# Altium project motion_board.PrjPcb
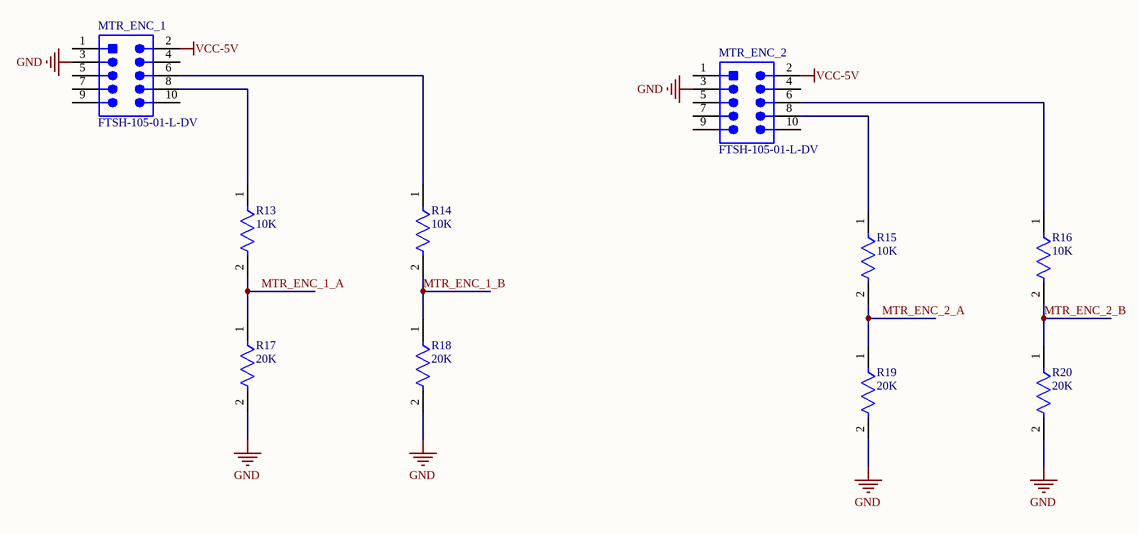
[diagram p0: MotorEncoders.SchDoc]
5 sheets, 27 parts. Net scope: global (net labels, ports and power ports of the same name join across sheets).
Board file: PCB_new.PcbDoc
Sheets:
  MotorEncoders.SchDoc
  Power.SchDoc
  STM32.SchDoc
  VoltageRegulator_3v3.SchDoc
  STLink.SchDoc

## Sheet MotorEncoders.SchDoc
size A; SheetNumber: 2; SheetTotal: 10

### Parts
MTR_ENC_1  FTSH-105-01-L-DV  [SMTC-FTSH-105-01-L-DV_V]
MTR_ENC_2  FTSH-105-01-L-DV  [SMTC-FTSH-105-01-L-DV_V]
R13  10K  [FP-RC0603-0_55-IPC_C]
R14  10K  [FP-RC0603-0_55-IPC_C]
R15  10K  [FP-RC0603-0_55-IPC_C]
R16  10K  [FP-RC0603-0_55-IPC_C]
R17  20K  [FP-RC0603-0_55-IPC_C]
R18  20K  [FP-RC0603-0_55-IPC_C]
R19  20K  [FP-RC0603-0_55-IPC_C]
R20  20K  [FP-RC0603-0_55-IPC_C]

### Nets
GND: MTR_ENC_1.3 MTR_ENC_2.3 R17.2 R18.2 R19.2 R20.2
VCC-5V: MTR_ENC_1.2 MTR_ENC_2.2
MTR_ENC_1_A: R13.2 R17.1
MTR_ENC_1_B: R14.2 R18.1
MTR_ENC_2_A: R15.2 R19.1
MTR_ENC_2_B: R16.2 R20.1
NetMTR_ENC_1_6: MTR_ENC_1.6 R14.1
NetMTR_ENC_1_8: MTR_ENC_1.8 R13.1
NetMTR_ENC_2_6: MTR_ENC_2.6 R16.1
NetMTR_ENC_2_8: MTR_ENC_2.8 R15.1

Not connected (* = marked no-connect by the designer): MTR_ENC_1 1 4 5 7 9 10; MTR_ENC_2 1 4 5 7 9 10

### Library data of the parts
MTR_ENC_1 MTR_ENC_2 = CMP-2000-05354-1: Male Header, Pitch 1.27 mm, 2 x 5 Position, Height 5.96 mm, -55 to 125 degC, RoHS, Bulk; Manufacturer: Samtec; Connector Type: Header,Unshrouded; Pitch: 0.050"(1.27mm); Mating Products: FLE-105-01-G-DV-TR-ND-CONNSKT1.27MM10POSDUALSMDCLP-105-02-G-D-P-TR-ND-CONNRCPT10POSDUAL.05"SMDSFMC-105-L2-S-D-TR-ND-CONN.05"SURFACE10POSSMTSFMH-105-02-L-D-TR-ND-CONNRECEPT10POS.50"SMTFLE-105-01-G-DV-A-ND-CONNSKT1.27MM10POSDUALSMDCLP-105-02-G-D-BE-ND-CONNRCPT10POSDUAL.05"SMDFLE-105-01-G-DV-A-P-ND-CONNSKT1.27MM10POSDUALSMDSAM1153-05-ND-CONNRCPT10POSDUAL.05"SMDSAM1155-05-ND-CONNRCPT10POSDUAL.05"SMDSAM1154-05-ND-CONNRCPT10POSDUAL.05"SMDSFMH-105-02-L-D-LC-ND-CONNRECEPT10POS.50"SMTSAM1226-05-ND-CONNRCPT.05"10POSDUALSMD; Catalog Drawings: FTSHSeriesFTSHSeriesSMTSide; Other Names: SAM1161-05; EDA / CAD Models: DownloadfromAcceleratedDesigns; Number of Positions Loaded: All; Number of Positions: 10; Featured Product: Board-To-BoardInterconnectSystems; Online Catalog: FTSHSeries; Product Training Modules: Board-to-BoardConnectors; Category: Connectors,Interconnects; Number of Rows: 2; Contact Finish: Gold; Termination: Solder; Mounting Type: SurfaceMount; Series: FTSH; Contact Mating Length: 0.120"(3.05mm); Row Spacing: 0.050"(1.27mm); Datasheet URL: https://datasheet.ciiva.com/30493/0900766b80adfe36-30493006.pdf; Contact Finish Thickness: 10µin(0.25µm); Features: -; Standard Package: 1; Packaging: Bulk; Datasheet Version: Feb-08; Manufacturer URL: http://www.samtec.com/; Fastening Type: -; Family: RectangularConnectors-Headers,MalePins; Contact Type: MalePin; Color: Black
R13-R16 = CMP-2100-03664-2: RES 10K OHM 1% 1/10W 0603; Voltage Rating: 75V; Voltage Rating (DC): 50V; Resistance: 10kR; Power Rating: 100mW; Temperature Coefficient: 100ppm/°C; Depth: 0.8mm; Termination: SMD/SMT; Resistor Type: Thick Film; Series: RC; Construction: Rectangular; Features: Moisture Resistant; Packaging: Tape and Reel; Min Operating Temperature: -55°C; Number of Terminations: 2; Lead Pitch: 0.3mm; RoHS Compliant: Yes; Case/Package: 0603; Resistance Tolerance: 1%; Military Standard: Not; Weight: 7.1E-05oz; Number of Pins: 2; Tolerance: 1%; Length: 1.6mm; Case Code (Imperial): 0603; Lead Free: Lead Free; Width: 0.8mm; Max Power Dissipation: 100mW; Height: 0.45mm; Max Operating Temperature: 155°C; Case Code (Metric): 1608; Size Code: 0603
R17-R20 = CMP-2000-06932-2: RES 20K OHM 1% 1/10W 0603; Voltage Rating: 50V; Temperature Coefficient: 100ppm/°C; Power Rating: 100mW; Resistance: 20kR; Height: 0.022inch; REACH SVHC: No SVHC; Case Code (Metric): 1608; Depth: 0.8mm; Tolerance: 1%; Min Operating Temperature: -55°C; Series: RC; RoHS Compliant: Yes; Resistor Type: Thick Film; Max Power Dissipation: 100mW; Features: Moisture Resistant; Max Operating Temperature: 155°C; Package Quantity: 1; Size Code: 0603; Packaging: Tape and Reel; Width: 0.031inch; Length: 0.063inch; Military Standard: Not; Technology: THICK FILM; Number of Terminations: 2; Termination: SMD/SMT; Construction: Rectangular; Case/Package: 0603; Number of Pins: 2; Lead Free: Lead Free; Voltage Rating (DC): 50V; Resistance Tolerance: 1%; Case Code (Imperial): 0603

## Sheet Power.SchDoc
size A; SheetNumber: 4; SheetTotal: 10
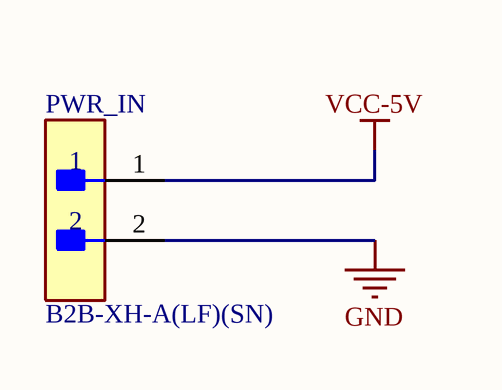
[diagram p1: Power.SchDoc]

### Parts
PWR_IN  B2B-XH-A(LF)(SN)  [FP-B2B-XH-A_LF_SN-MFG]

### Nets
GND: PWR_IN.2
VCC-5V: PWR_IN.1

### Library data of the parts
PWR_IN = CMP-2000-05888-3: CONN HEADER VERT 2POS 2.5MM; Current Rating: 3A; Voltage Rating: 250V; Number of Contacts: 2; Contact Resistance: 20mR; Wire/Cable Gauge: 22AWG; Insulation Resistance: 1GR; Connector Type: Male Pin; Packaging: Bulk; Contact Material: Brass; Lead Free: Lead Free; Orientation: Straight; Contact Plating: Tin; Max Current Rating: 3A; Termination: Solder; Fastening Type: Detent; Depth: 5.75mm; Housing Material: Polyamide; REACH SVHC: No SVHC; Series: XH; Voltage Rating (AC): 250V; Number of Positions: 2; Color: Natural; Contact Type: Male Pin; Max Voltage Rating (DC): 250V; Pitch: 2.5mm; Lead Pitch: 2.5mm; Mount: Through Hole; Max Operating Temperature: 85°C; Length: 7.4mm; Max Voltage Rating (AC): 250V; Min Operating Temperature: -25°C; Number of Rows: 1; Housing Color: White

## Sheet STM32.SchDoc
size A; SheetNumber: 5; SheetTotal: 10
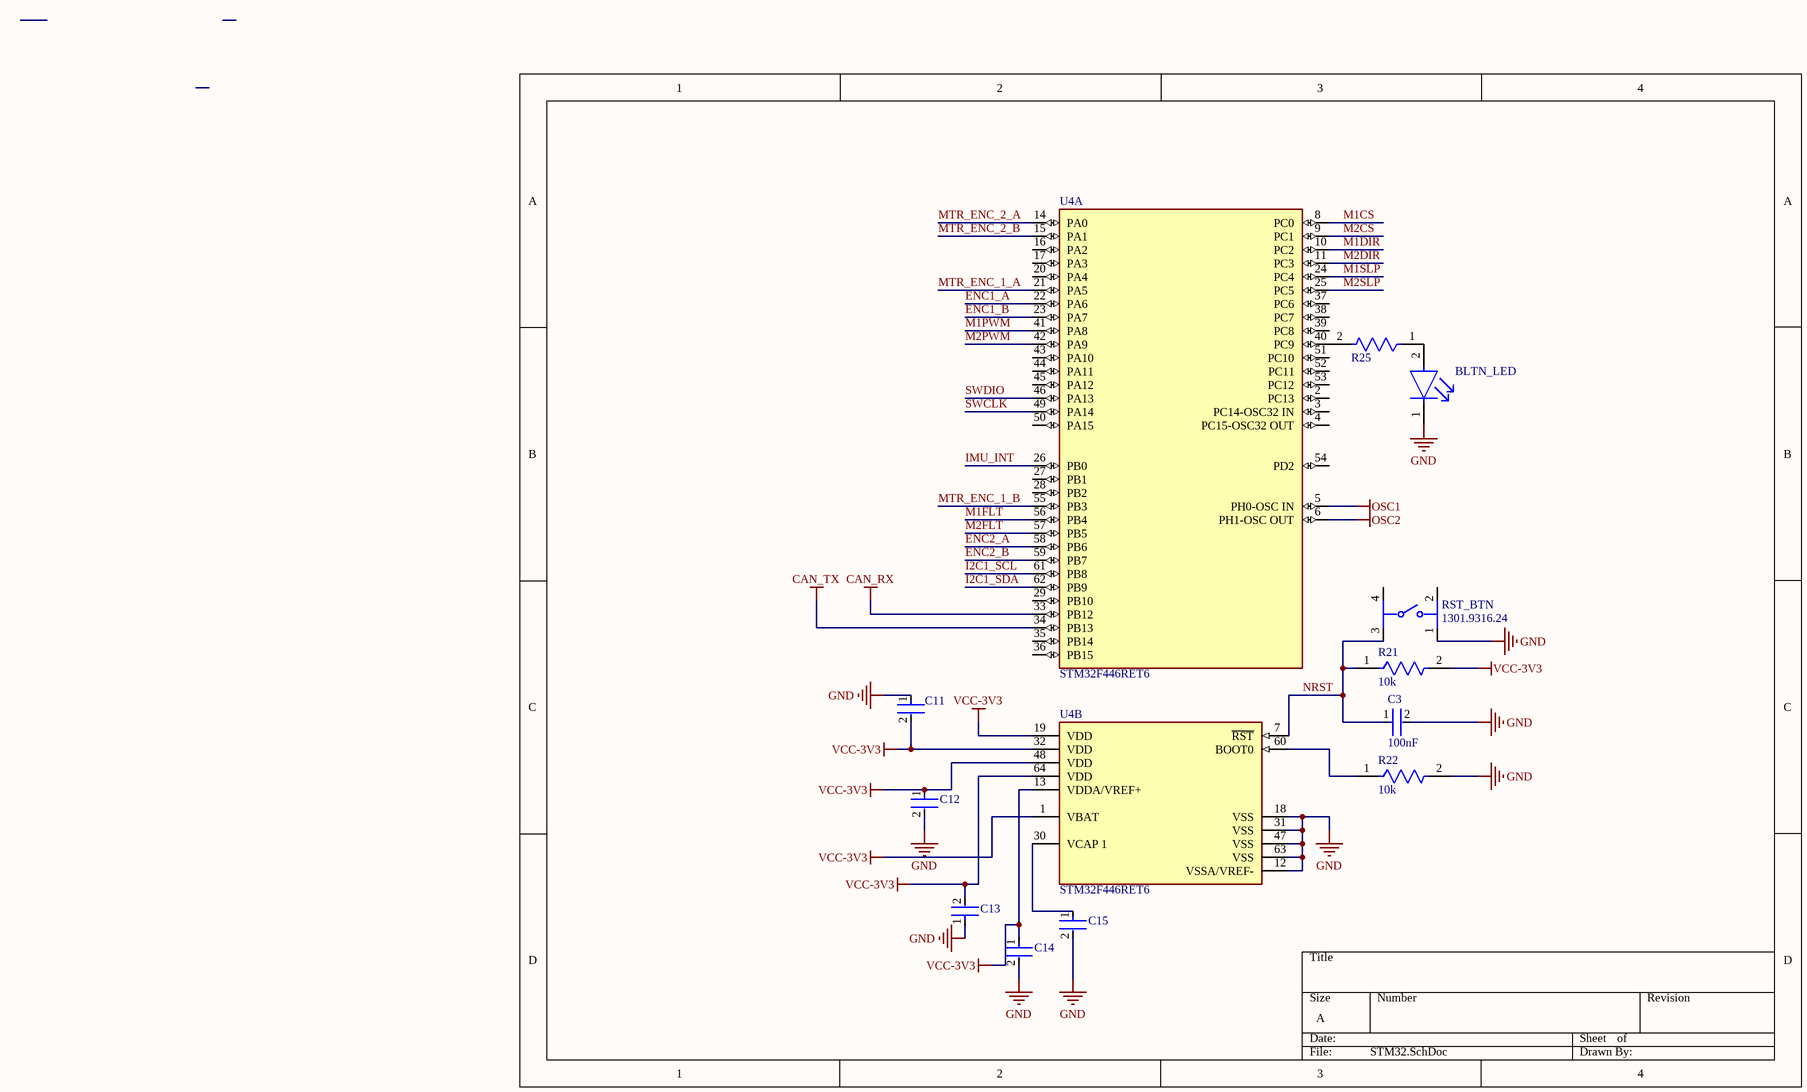
[diagram p2: STM32.SchDoc]

### Parts
BLTN_LED  APHCM2012CGCK-F01  [FP-APHCM2012CGCK-F01-MFG]  (value not drawn)
C3  100nF  [FP-0402B104K160CT-IPC_C]
C11  CC0603KRX7R9BB104  [FP-CC0603-DA-MFG]  (value not drawn)
C12  CC0603KRX7R9BB104  [FP-CC0603-DA-MFG]  (value not drawn)
C13  CC0603KRX7R9BB104  [FP-CC0603-DA-MFG]  (value not drawn)
C14  CC0603KRX7R9BB104  [FP-CC0603-DA-MFG]  (value not drawn)
C15  CL10A475KP8NNNC  [FP-CL10-IPC_C]  (value not drawn)
R21  10k  [FP-RC0603-0_55-IPC_C]
R22  10k  [FP-RC0603-0_55-IPC_C]
R25  AC0603FR-10470RL  [FP-AC0603-IPC_A]  (value not drawn)
RST_BTN  1301.9316.24  [FP-1301_9316_24-MFG]
U4  STM32F446RET6  [FP-LQFP64-5W-MFG]  (parts A,B of 2)

### Nets
CAN_RX: U4.33(PB12)
CAN_TX: U4.34(PB13)
GND: BLTN_LED.1(C) C3.2 C11.1 C12.2 C13.1 C14.2 C15.2 R22.2 RST_BTN.1 U4.12(VSSA/VREF-) U4.18(VSS) U4.31(VSS) U4.47(VSS) U4.63(VSS)
OSC1: U4.5(PH0-OSC_IN)
OSC2: U4.6(PH1-OSC_OUT)
VCC-3V3: C11.2 C12.1 C13.2 C14.1 R21.2 U4.1(VBAT) U4.13(VDDA/VREF+) U4.19(VDD) U4.32(VDD) U4.48(VDD) U4.64(VDD)
ENC1_A: U4.22(PA6)
ENC1_B: U4.23(PA7)
ENC2_A: U4.58(PB6)
ENC2_B: U4.59(PB7)
I2C1_SCL: U4.61(PB8)
I2C1_SDA: U4.62(PB9)
IMU_INT: U4.26(PB0)
M1CS: U4.8(PC0)
M1DIR: U4.10(PC2)
M1FLT: U4.56(PB4)
M1PWM: U4.41(PA8)
M1SLP: U4.24(PC4)
M2CS: U4.9(PC1)
M2DIR: U4.11(PC3)
M2FLT: U4.57(PB5)
M2PWM: U4.42(PA9)
M2SLP: U4.25(PC5)
MTR_ENC_1_A: U4.21(PA5)
MTR_ENC_1_B: U4.55(PB3)
MTR_ENC_2_A: U4.14(PA0)
MTR_ENC_2_B: U4.15(PA1)
NRST: C3.1 R21.1 RST_BTN.3 U4.7(~{RST})
SWCLK: U4.49(PA14)
SWDIO: U4.46(PA13)
NetBLTN_LED_2: BLTN_LED.2(A) R25.1
NetC15_1: C15.1 U4.30(VCAP_1)
NetR22_1: R22.1 U4.60(BOOT0)
NetR25_2: R25.2 U4.40(PC9)

Not connected (* = marked no-connect by the designer): RST_BTN 2 4; U4 2(PC13) 3(PC14-OSC32_IN) 4(PC15-OSC32_OUT) 16(PA2) 17(PA3) 20(PA4) 27(PB1) 28(PB2) 29(PB10) 35(PB14) 36(PB15) 37(PC6) 38(PC7) 39(PC8) 43(PA10) 44(PA11) 45(PA12) 50(PA15) 51(PC10) 52(PC11) 53(PC12) 54(PD2)

### Library data of the parts
BLTN_LED = CMP-44529-000062-1: LED GREEN CLEAR CHIP SMD; Dominant Wavelength: 570nm; Forward Current: 20mA; Number of LEDs: 1; Luminous Intensity: 40mcd; Forward Voltage: 2.1V; Viewing Angle: 110°; Illumination Color: Green; Lens Style: Clear; Mount: Surface Mount; Length: 2mm; Max Operating Temperature: 85°C; Series: APHCM; Width: 1.25mm; Lead Free: Lead Free; Wavelength: 570nm; Package Quantity: 1; Number of Pins: 2; Case Code (Metric): 2012; RoHS Compliant: Yes; Packaging: Tape and Reel; Lens Color: Clear; Case/Package: 0805; Case Code (Imperial): 0805; Test Current: 20mA; Color: Green; Min Operating Temperature: -40°C; Height: 0.4mm
C3 = CMP-45632-000002-1: CAP CER 0.1UF 16V X7R 0402; Tolerance: 10%; Case Code (Imperial): 0402; Length: 1mm; Radiation Hardening: No; Case Code (Metric): 1005; Max Operating Temperature: 125°C; Voltage Rating: 16V; Capacitance: 100nF; Voltage Rating (DC): 16V; Dielectric: X7R; RoHS Compliant: Yes; Packaging: Tape and Reel; Lead Free: Lead Free; Depth: 0.5mm; Case/Package: 0402; Min Operating Temperature: -55°C; Series: -
C11-C14 = CMP-2100-03601-2: CAP CER 0.1UF 50V X7R 0603; Manufacturer: YAGEO; Material: Ceramic; Capacitance: 100 nF; Temperature Coefficient: 15%; Tolerance: 0.1; Value: 100 nF; Description: CC0603 100 nF X7R 10.00% 50 V; Height: 0.9mm; Voltage: 50 V; ComponentLink2Description: Datasheet; Device Class L2: Capacitors; Temperature Range High: +125°C; Category: Cap; Footprint Url: http://www.yageo.com/exep/pages/download/literatures/UPY-C_GEN_24.pdf; ComponentLink2URL: http://www.yageo.com/documents/recent/UPY-GPHC_X7R_6.3V-to-50V_18.pdf; Package: CC0603-DA; Temperature: -55°C to +125°C; Voltage Rating: 50 V; Temperature Characteristic: X7R; Device Class L1: Passive Components; Temperature Range Low: -55°C; Manufacturer Part Number: CC0603KRX7R9BB104; RoHS: TRUE; Automotive: No; Device Class L3: Ceramic Capacitors; Octopart: https://octopart.com/cc0603krx7r9bb104-yageo-42244635; Mouser Description: Multilayer Ceramic Capacitor, CC Series, 0.1 - F, - 10%, X7R, 50 V, 0603 [1608 Metric]; Lead Free: Yes; Digikey Description: CAP CER 0.1UF 50V X7R 0603
C15 = CMP-13271-003017-1: Cap Ceramic 4.7uF 10V X5R ±10% Pad SMD 0603 +85°C T/R; Capacitance: 4.7uF; Case/Package: 0603; Packaging: Tape and Reel; Width: 0.031inch; Contact Plating: Tin; Thickness: 0.035inch; Package Quantity: 1; Voltage Rating: 10V; Case Code (Metric): 1608; Case Code (Imperial): 0603; Depth: 0.8mm; Height: 0.8mm; Tolerance: 10%; Max Operating Temperature: 85°C; Length: 1.6mm; Dielectric: X5R; Mount: Surface Mount; Radiation Hardening: No; Min Operating Temperature: -55°C
R21 R22 = CMP-2100-03664-2: as R13 on sheet MotorEncoders; Depth: 0.8mm; Termination: SMD/SMT; Resistor Type: Thick Film; Series: RC; Construction: Rectangular; Features: Moisture Resistant; Packaging: Tape and Reel; Min Operating Temperature: -55°C; Number of Terminations: 2; Lead Pitch: 0.3mm; RoHS Compliant: Yes; Case/Package: 0603; Resistance Tolerance: 1%; Military Standard: Not; Weight: 7.1E-05oz; Number of Pins: 2; Tolerance: 1%; Length: 1.6mm; Case Code (Imperial): 0603; Lead Free: Lead Free; Width: 0.8mm; Max Power Dissipation: 100mW; Height: 0.45mm; Max Operating Temperature: 155°C; Case Code (Metric): 1608; Size Code: 0603
R25 = CMP-03412-002877-2: RES 470Ω 1.00% 0.1W 0603; Tolerance: 1%; Resistance: 470R; Case/Package: 0603; RoHS Compliant: Yes
RST_BTN = CMP-26321-000004-1: LSH 6X6 SHORT TRAVEL SWITCH 7.00; Voltage Rating (DC): 12V; Mechanical Life: 100000Cycles; Throw Configuration: SPST; Operating Force: 1.6N; Max Current Rating: 50mA; Min Operating Temperature: -20°C; Mount: Surface Mount; Max Voltage Rating (DC): 12V; Length: 6mm; Packaging: Tape and Reel; Case/Package: SMD/SMT; Radiation Hardening: No; Orientation: Straight; Termination: Gull Wing; RoHS Compliant: Yes; Max Operating Temperature: 70°C; Depth: 10mm
U4 = CMP-12105-000007-1: IC MCU 32BIT 512KB FLASH 64LQFP; Manufacturer: ST; Number Of Spi Channels: 4; Ram Size: 128KBytes; Standoff Height: 0.05mm; Number Of Uart Channels: 6; Number Of Pwm Channels: 32; Max Junction Temp: +105°C; Number Of I/Os: 50; Number Of Usb Channels: 2; Frequency: 180MHz; Number Of A/D Converters: 3; Max Supply Voltage: 3.6V; Number Of Adc Channels: 16; Interface: I2C,SPI,UART,USART,CAN,USB,LIN,IrDA,I2S,Other; Memory Size: 512KBytes; Number Of Timers/Counters: 14; Min Supply Voltage: 1.7V; Core Architecture: ARM Cortex-M4; Data Bus Width: 32bits; Number Of Cores: 1; Ambient Temperature Range Low: -40°C; ComponentLink2URL: https://www.st.com/en/microcontrollers-microprocessors/stm32f446re.html; Category: IC; Height: 1.6mm; Ipc Land Pattern Name: QFP50P1200X1200X160-64; Manufacturer Part Number: STM32F446RET6; Octopart: https://octopart.com/stm32f446ret6-stmicroelectronics-52642920; Temperature Range High: +105°C; Lead Free: Yes; Mouser Description: ARM Microcontrollers - MCU High-performance and DSP with FP, ARM Cortex-M4 MCU with 512 Kbytes Flash, 180 MHz CPU, Art Accelerator, SDRAM; Digikey Description: IC MCU 32BIT 512KB FLASH 64LQFP; Ambient Temperature Range High: +85°C; Number Of I2C Channels: 4; Memory Type: FLASH; RoHS: TRUE; Automotive: No; Device Class L1: Integrated Circuits (ICs); Temperature: -40°C to +105°C; Device Class L2: Embedded Processors and Controllers; Device Class L3: Microcontrollers; Temperature Range Low: -40°C; Package: LQFP64-5W; ComponentLink2Description: Datasheet

## Sheet VoltageRegulator_3v3.SchDoc
size A; SheetNumber: 6; SheetTotal: 10
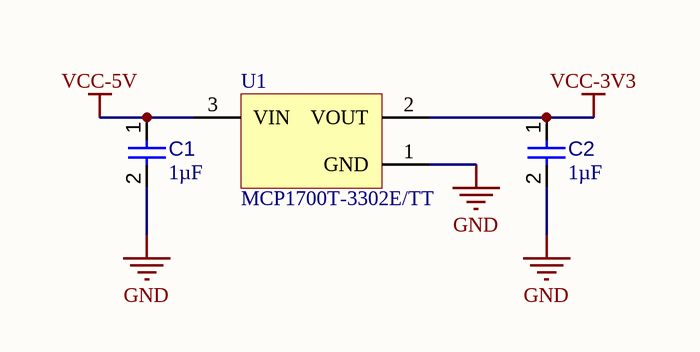
[diagram p3: VoltageRegulator_3v3.SchDoc]

### Parts
C1  value 1µF  [CAPC0603(1608)100_L]  (hidden comment: Capacitor 1µF +/-40% 50V 0603)
C2  value 1µF  [CAPC0603(1608)100_L]  (hidden comment: Capacitor 1µF +/-40% 50V 0603)
U1  MCP1700T-3302E/TT  [SOT-23-TT3_N]

### Nets
GND: C1.2 C2.2 U1.1(GND)
VCC-3V3: C2.1 U1.2(VOUT)
VCC-5V: C1.1 U1.3(VIN)

### Library data of the parts
C1 C2 = CMP-001-00078-4: Chip Capacitor, 1µF +/-40%, 50V, 0603, Thickness 1 mm; Tolerance: 10%; Min Operating Temperature: -55°C; Max Operating Temperature: 85°C; Case/Package: 0603; Voltage Rating: 50V; Pins: 2; Mounting Technology: SMT
U1 = CMP-0136-00791-1: Low Quiescent Current LDO, 3-Pin SOT-23, Extended Temperature, Tape and Reel; PackageVersion: revBB, Aug-2009; Code_IPC: SOT23-3; PackageReference: SOT-23-TT3; DatasheetVersion: revB, Feb-2007; PackageDescription: 3-Lead Plastic Small Outline Transistor (TT) [SOT-23]

## Sheet STLink.SchDoc
size A; SheetNumber: 7; SheetTotal: 10
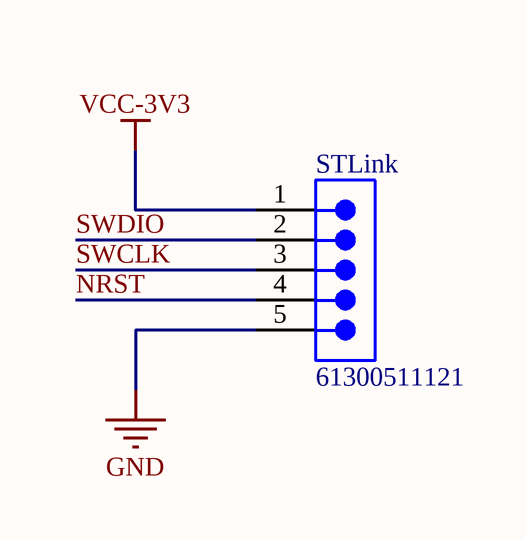
[diagram p4: STLink.SchDoc]

### Parts
STLink  61300511121  [61300511121]

### Nets
GND: STLink.5
VCC-3V3: STLink.1
NRST: STLink.4
SWCLK: STLink.3
SWDIO: STLink.2

### Library data of the parts
STLink = CMP-1502-01068-4: THT Vertical Pin Header WR-PHD, Pitch 2.54 mm, Single Row, 5 pins; Number of Contacts: 5; Connector Type: Male Pin; Operating Supply Voltage: 250V; Contact Resistance: 20mΩ; Gender: Male; Pitch: 2.54mm; Current Rating: 3A; Min Operating Temperature: -40°C; Contact Material: Gold; Color: Black; RoHS: Compliant; Number of Rows: 1; Lead Free: Lead Free; Height: 8.89mm; Contact Plating: Gold; Number of Pins: 5; Orientation: Vertical; Voltage Rating: 250V; Packaging: Bulk; Number of Positions: 5; Max Operating Temperature: 105°C; Termination: Solder; Lead Pitch: 2.54mm; Contact Mating Length: 5.9944mm; Mount: Through Hole

## Nets that join several sheets
GND: MotorEncoders (6 pins), Power (PWR_IN.2), STM32 (14 pins), VoltageRegulator_3v3 (C1.2 C2.2 U1.1), STLink (STLink.5)
VCC-3V3: STM32 (11 pins), VoltageRegulator_3v3 (C2.1 U1.2), STLink (STLink.1)
VCC-5V: MotorEncoders (MTR_ENC_1.2 MTR_ENC_2.2), Power (PWR_IN.1), VoltageRegulator_3v3 (C1.1 U1.3)
MTR_ENC_1_A: MotorEncoders (R13.2 R17.1), STM32 (U4.21)
MTR_ENC_1_B: MotorEncoders (R14.2 R18.1), STM32 (U4.55)
MTR_ENC_2_A: MotorEncoders (R15.2 R19.1), STM32 (U4.14)
MTR_ENC_2_B: MotorEncoders (R16.2 R20.1), STM32 (U4.15)
NRST: STM32 (C3.1 R21.1 RST_BTN.3 U4.7), STLink (STLink.4)
SWCLK: STM32 (U4.49), STLink (STLink.3)
SWDIO: STM32 (U4.46), STLink (STLink.2)